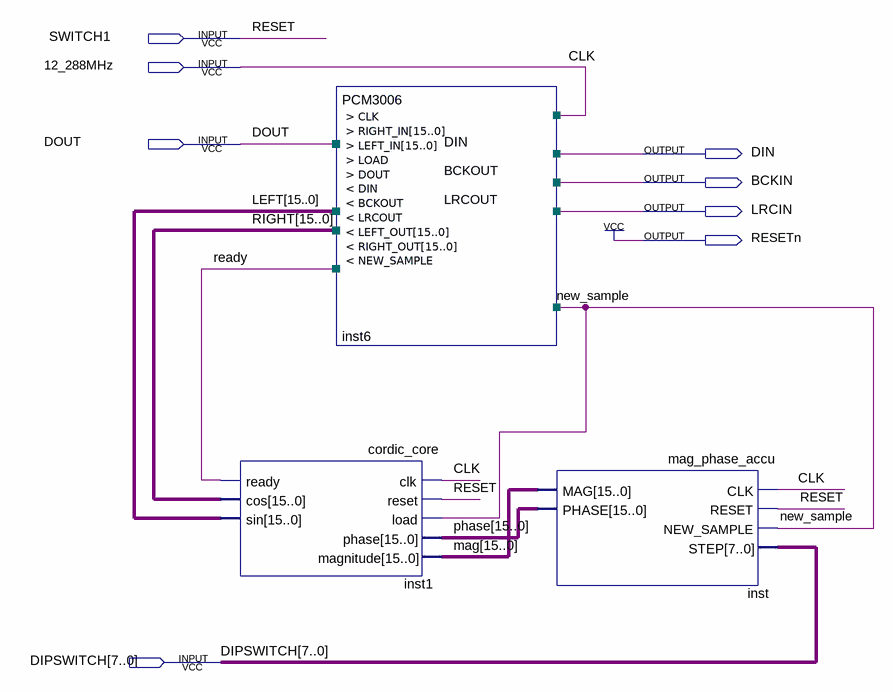
[diagram p0: schematic sheet]
// Quartus schematic ex12.bdf as structural Verilog: 3 symbols, 8 pins
module ex12 (
  input  SWITCH1,
  input  \12_288MHz ,
  input  DOUT,
  input  [7:0] DIPSWITCH,
  output DIN,
  output BCKIN,
  output LRCIN,
  output RESETn
);

  wire new_sample, ready;
  wire [15:0] LEFT, mag, phase, RIGHT;

  cordic_core inst1 (
    .clk(\12_288MHz ), .reset(SWITCH1), .load(new_sample), .phase(phase), .magnitude(mag), .ready(ready),
    .cos(RIGHT), .sin(LEFT));
  PCM3006 inst6 (
    .CLK(\12_288MHz ), .RIGHT_IN(LEFT), .LEFT_IN(RIGHT), .LOAD(ready), .DOUT(DOUT), .DIN(DIN),
    .BCKOUT(BCKIN), .LRCOUT(LRCIN), .NEW_SAMPLE(new_sample));  // open: LEFT_OUT, RIGHT_OUT
  mag_phase_accu inst (
    .CLK(\12_288MHz ), .RESET(SWITCH1), .NEW_SAMPLE(new_sample), .STEP(DIPSWITCH), .MAG(mag), .PHASE(phase));

  assign RESETn = 1'b1;

  // Other names for the same wires on the sheet: BCKOUT = BCKIN; CLK = \12_288MHz ; LRCOUT = LRCIN; RESET = SWITCH1
endmodule
